# Altium project myMeteo_v0.PrjPcb
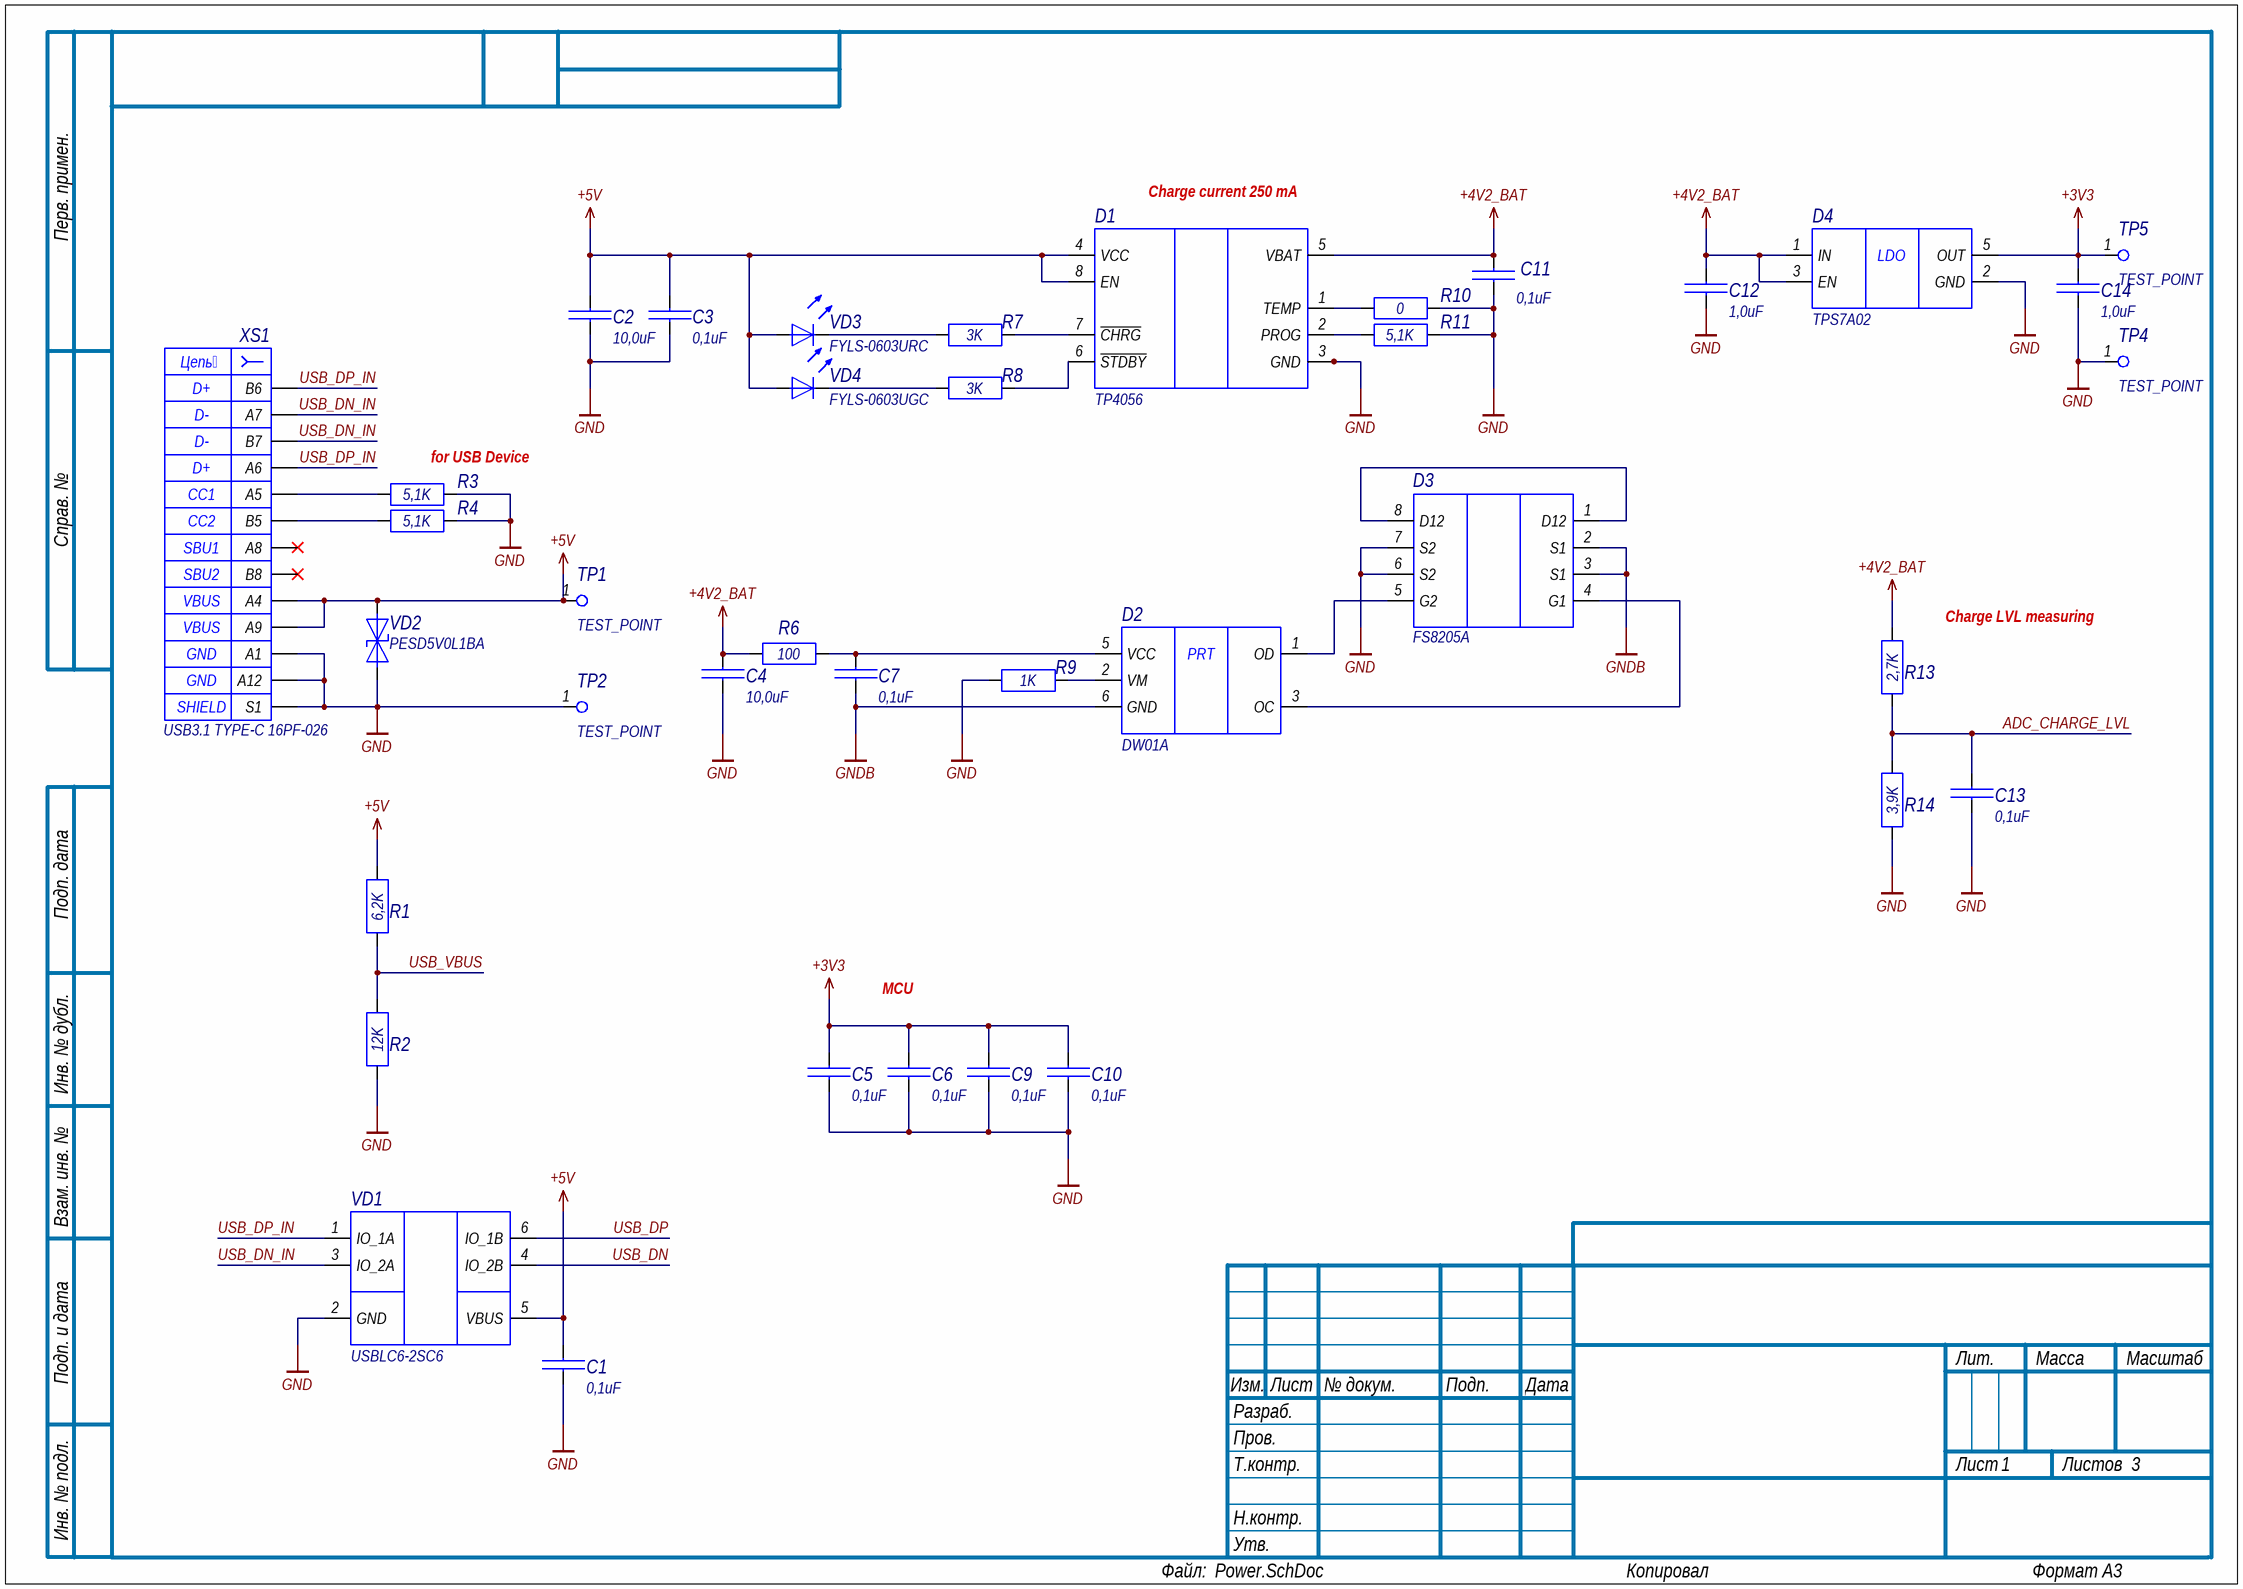
[diagram p0: Power.SchDoc]
3 sheets, 72 parts. Net scope: global (net labels, ports and power ports of the same name join across sheets).
Board file: myMeteo_v0.PcbDoc
Sheets:
  Power.SchDoc
  MCU.SchDoc
  Sensors.SchDoc

## Sheet Power.SchDoc
size 420 x 297 mm; SheetNumber: 1; SheetTotal: 3

### Parts
C1  value 0,1uF  [CAP_0603]  (hidden comment: CAPACITOR)
C2  value 10,0uF  [CAP_0603]  (hidden comment: CAPACITOR)
C3  value 0,1uF  [CAP_0603]  (hidden comment: CAPACITOR)
C4  value 10,0uF  [CAP_0603]  (hidden comment: CAPACITOR)
C5  value 0,1uF  [CAP_0603]  (hidden comment: CAPACITOR)
C6  value 0,1uF  [CAP_0603]  (hidden comment: CAPACITOR)
C7  value 0,1uF  [CAP_0603]  (hidden comment: CAPACITOR)
C9  value 0,1uF  [CAP_0603]  (hidden comment: CAPACITOR)
C10  value 0,1uF  [CAP_0603]  (hidden comment: CAPACITOR)
C11  value 0,1uF  [CAP_0603]  (hidden comment: CAPACITOR)
C12  value 1,0uF  [CAP_0603]  (hidden comment: CAPACITOR)
C13  value 0,1uF  [CAP_0603]  (hidden comment: CAPACITOR)
C14  value 1,0uF  [CAP_0603]  (hidden comment: CAPACITOR)
D1  TP4056  [ESOP-8]
D2  DW01A  [SOT-23-6]
D3  FS8205A  [TSSOP-8]
D4  TPS7A02  [SOT-23-5]
R1  value 6,2K  [RES_0603]  (hidden comment: RESISTOR)
R2  value 12K  [RES_0603]  (hidden comment: RESISTOR)
R3  value 5,1K  [RES_0603]  (hidden comment: RESISTOR)
R4  value 5,1K  [RES_0603]  (hidden comment: RESISTOR)
R6  value 100  [RES_0603]  (hidden comment: RESISTOR)
R7  value 3K  [RES_0603]  (hidden comment: RESISTOR)
R8  value 3K  [RES_0603]  (hidden comment: RESISTOR)
R9  value 1K  [RES_0603]  (hidden comment: RESISTOR)
R10  value 0  [RES_0603]  (hidden comment: RESISTOR)
R11  value 5,1K  [RES_0603]  (hidden comment: RESISTOR)
R13  value 2,7K  [RES_0603]  (hidden comment: RESISTOR)
R14  value 3,9K  [RES_0603]  (hidden comment: RESISTOR)
TP1  TEST_POINT  [TP-SMD-R0.9x0.85]  (no BOM)
TP2  TEST_POINT  [TP-SMD-R0.9x0.85]  (no BOM)
TP4  TEST_POINT  [TP-SMD-R0.9x0.85]  (no BOM)
TP5  TEST_POINT  [TP-SMD-R0.9x0.85]  (no BOM)
VD1  USBLC6-2SC6  [SOT-23-6]
VD2  value PESD5V0L1BA  [SOD-323F-NO-CATHODE]  (hidden comment: ZENER BIDIR)
VD3  value FYLS-0603URC  [LED_0603_R]  (hidden comment: LED)
VD4  value FYLS-0603UGC  [LED_0603_G]  (hidden comment: LED)
XS1  value USB3.1 TYPE-C 16PF-026  [USB3.1TYPE-C 16PF-26]  (hidden comment: USB3.1TYPE-C 16PF-26)

### Nets
+3V3: C5.1 C6.1 C9.1 C10.1 C14.2 D4.5(OUT) TP5.1
+4V2_BAT: C4.1 C11.1 C12.2 D1.5(VBAT) D4.1(IN) D4.3(EN) R6.1 R13.2
+5V: C1.1 C2.1 C3.1 D1.4(VCC) D1.8(EN) R1.2 TP1.1 VD1.5(VBUS) VD2.1 VD3.A VD4.A XS1.A4 XS1.A9
GND: C1.2 C2.2 C3.2 C4.2 C5.2 C6.2 C9.2 C10.2 C11.2 C12.1 C13.2 C14.1 D1.0(EPAD) D1.3(GND) D3.6(S2) D3.7(S2) D4.2(GND) R2.1 R3.2 R4.2 R9.1 R10.2 R11.2 R14.1 TP2.1 TP4.1 VD1.2(GND) VD2.2 XS1.A1 XS1.A12 XS1.S1
GNDB: C7.2 D2.6(GND) D3.2(S1) D3.3(S1)
ADC_CHARGE_LVL: C13.1 R13.1 R14.2
USB_DN: VD1.4(IO_2B)
USB_DN_IN: VD1.3(IO_2A) XS1.A7 XS1.B7
USB_DP: VD1.6(IO_1B)
USB_DP_IN: VD1.1(IO_1A) XS1.A6 XS1.B6
USB_VBUS: R1.1 R2.2
NetC7_1: C7.1 D2.5(VCC) R6.2
NetD1_1: D1.1(TEMP) R10.1
NetD1_2: D1.2(PROG) R11.1
NetD1_6: D1.6(~{STDBY}) R8.2
NetD1_7: D1.7(~{CHRG}) R7.2
NetD2_1: D2.1(OD) D3.5(G2)
NetD2_2: D2.2(VM) R9.2
NetD2_3: D2.3(OC) D3.4(G1)
NetD3_1: D3.1(D12) D3.8(D12)
NetR3_1: R3.1 XS1.A5
NetR4_1: R4.1 XS1.B5
NetR7_1: R7.1 VD3.K
NetR8_1: R8.1 VD4.K

Not connected (* = marked no-connect by the designer): XS1 A8* B8*

### Notes on the sheet
- (near D1) Charge current 250 mA
- (near R3) for USB Device
- Charge LVL measuring
- MCU
- Перв. примен.
- Справ. №
- Подп. дата
- Инв. № дубл.
- Взам. инв. №
- Подп. и дата
- Изм.
- Разраб.
- Лист
- № докум.
- Подп.
- Дата
- Лит.
- Масса
- Масштаб
- Пров.
- Т.контр.
- Листов
- Инв. № подл.
- Н.контр.
- Утв.
- Файл:
- Копировал
- Формат А3
- (in symbol DW01A) PRT
- (in symbol USB3.1 TYPE-C 16PF-026) Цепь; D+; D-; CC1; CC2; SBU1; SBU2; VBUS; GND; SHIELD

### Library data of the parts
C1 C3 C5-C7 C9-C11 C13 = CAP_CER_0603_104_25_10_X7R: Ceramic Capacitor SMD_0603 X7R; Manufacturer: Yageo; Manufacturer Part Number: CC0603KRX7R8BB104; Voltage: 25V; Tolerance: 10%; Part Number: CAP_CER_0603_104_25_10_X7R; Part Type: 0603; Size: 0603; Dielectric: X7R
C2 = CAP_CER_0603_106_25_10_X5R: Ceramic Capacitor SMD_0603 X5R; Manufacturer: Yageo; Manufacturer Part Number: CC0603KRX5R8BB106; Voltage: 25V; Tolerance: 10%; Replace: GRM188R61E106KA73D; Part Number: CAP_CER_0603_106_25_10_X5R; Part Type: 0603; Size: 0603; Dielectric: X5R
C4 = CAP_CER_0603_106_10_10_X5R: Ceramic Capacitor SMD_0603 X5R; Manufacturer: Yageo; Manufacturer Part Number: CC0603KRX5R6BB106; Voltage: 10V; Tolerance: 10%; Part Number: CAP_CER_0603_106_10_10_X5R; Part Type: 0603; Size: 0603; Dielectric: X5R
C12 C14 = CAP_CER_0603_105_25_10_X5R: Ceramic Capacitor SMD_0603 X5R; Manufacturer: Yageo; Manufacturer Part Number: CC0603KRX5R8BB105; Voltage: 25V; Tolerance: 10%; Part Number: CAP_CER_0603_105_25_10_X5R; Part Type: 0603; Size: 0603; Dielectric: X5R
D1 = TP4056: 1A Standalone Linear Li-Ion Battery Charger; Manufacturer: UMW; Value: TP4056; Part Number: TP4056; Part Type: POWER; Size: ESOP-8; Manufacturer Part Number: TP4056
D2 = DW01A: The DW01A battery protection IC is designed to / protect lithium-ion/polymer battery from damage or / degrading the lifetime due to overcharge, / overdischarge, and/or overcurrent for one-cell / lithium-ion/polymer battery powered systems, such as / cellular phones; Value: DW01A; Part Number: DW01A; Part Type: POWER; Size: SOT-23-6; Manufacturer: -; Manufacturer Part Number: DW01A
D3 = FS8205A: Dual N-Channel Enhancement Mode Power MOSFET; Manufacturer: Tech Public; Value: FS8205A; Part Number: FS8205A; Part Type: POWER; Size: TSSOP-8; Manufacturer Part Number: FS8205A
D4 = TPS7A02: TPS7A02 Nanopower IQ, 25-nA, 200-mA, Low-Dropout Voltage Regulator With Fast / Transient Response; Manufacturer: Texas Instruments; Manufacturer Part Number: TPS7A0236PDBVR; Value: TPS7A02; Part Number: TPS7A02; Part Type: LDO; Size: SOT-23-5
R1 = RES_SMD_0603_6K2_5%: Resistor fixed SMD_0603 5%; Manufacturer: Yageo; Manufacturer Part Number: RC0603JR-076K2L; Power: 100mW; Part Number: RES_SMD_0603_6K2_5%; Part Type: 0603; Tolerance: 5%; Size: 0603
R2 = RES_SMD_0603_12K_1%: Resistor fixed SMD_0603 1%; Manufacturer: Yageo; Manufacturer Part Number: RC0603FR-0712KL; Power: 100mW; Part Number: RES_SMD_0603_12K_1%; Part Type: 0603; Tolerance: 1%; Size: 0603
R3 R4 R11 = RES_SMD_0603_5K1_5%: Resistor fixed SMD_0603 5%; Manufacturer: Yageo; Manufacturer Part Number: RC0603JR-075K1L; Power: 100mW; Part Number: RES_SMD_0603_5K1_5%; Part Type: 0603; Tolerance: 5%; Size: 0603
R6 = RES_SMD_0603_100R_5%: Resistor fixed SMD_0603 5%; Manufacturer: Yageo; Manufacturer Part Number: RC0603JR-07100RL; Power: 100mW; Part Number: RES_SMD_0603_100R_5%; Part Type: 0603; Tolerance: 5%; Size: 0603
R7 R8 = RES_SMD_0603_3K_5%: Resistor fixed SMD_0603 5%; Manufacturer: Yageo; Manufacturer Part Number: RC0603JR-073KL; Power: 100mW; Part Number: RES_SMD_0603_3K_5%; Part Type: 0603; Tolerance: 5%; Size: 0603
R9 = RES_SMD_0603_1K_5%: Resistor fixed SMD_0603 5%; Manufacturer: Yageo; Manufacturer Part Number: RC0603JR-071KL; Power: 100mW; Part Number: RES_SMD_0603_1K_5%; Part Type: 0603; Tolerance: 5%; Size: 0603
R10 = RES_SMD_0603_0R_5%: Resistor fixed SMD_0603 5%; Manufacturer: Yageo; Manufacturer Part Number: RC0603JR-070RL; Power: 100mW; Part Number: RES_SMD_0603_0R_5%; Part Type: 0603; Tolerance: 5%; Size: 0603
R13 = RES_SMD_0603_2K7_5%: Resistor fixed SMD_0603 5%; Manufacturer: Yageo; Manufacturer Part Number: RC0603JR-072K7L; Power: 100mW; Part Number: RES_SMD_0603_2K7_5%; Part Type: 0603; Tolerance: 5%; Size: 0603
R14 = RES_SMD_0603_3K9_5%: Resistor fixed SMD_0603 5%; Manufacturer: Yageo; Manufacturer Part Number: RC0603JR-073K9L; Power: 100mW; Part Number: RES_SMD_0603_3K9_5%; Part Type: 0603; Tolerance: 5%; Size: 0603
TP1 TP2 TP4 TP5 = TP-SMD-R0.9x0.85: Test Point, SMP Pad, 0.9x0.85mm; Value: TP; Part Number: TP-SMD-R0.9x0.85; Part Type: TP-SMD-R0.9x0.85
VD1 = USBLC6-2SC6: Low Capacitance 2-Line ESD Protection for USB Protection; Manufacturer: UMW; Voltage: 5V; Replace: USBLC6-2SC6 (STM); Value: USBLC6-2SC6; Part Number: USBLC6-2SC6; Part Type: ESD; Size: SOT-23-6; Manufacturer Part Number: USBLC6-2SC6
VD2 = PESD5V0L1BA: Low Capacitance Bidirectional ESD Protection Diode; Manufacturer: UMW; Voltage: 5V; Part Number: PESD5V0L1BA; Part Type: ESD; Size: SOD-323; Manufacturer Part Number: PESD5V0L1BA
VD3 = FYLS-0603URC: SMD 0603 LED Red; Manufacturer: Foryard; Part Number: FYLS-0603URC; Part Type: LED; Size: 0603; Manufacturer Part Number: FYLS-0603URC
VD4 = FYLS-0603UGC: SMD 0603 LED Green; Manufacturer: Foryard; Replace: BL-HGE36G-AV-TR8; Part Number: FYLS-0603UGC; Part Type: LED; Size: 0603; Manufacturer Part Number: FYLS-0603UGC
XS1 = USB3.1 TYPE-C 16PF-026: USB3.1 as USB2.0. Original: USB4110-GF_A; Manufacturer: RUICHI; Manufacturer Part Number: RUICHI USB3.1 TYPE-C; Replace: USB4110-GF-A (GCT); Part Number: USB3.1 TYPE-C 16PF-026; Part Type: PC

## Sheet MCU.SchDoc
size 420 x 297 mm; Author: ALTIUM GOSTBOM2.0 KEV; SheetNumber: 2; SheetTotal: 3
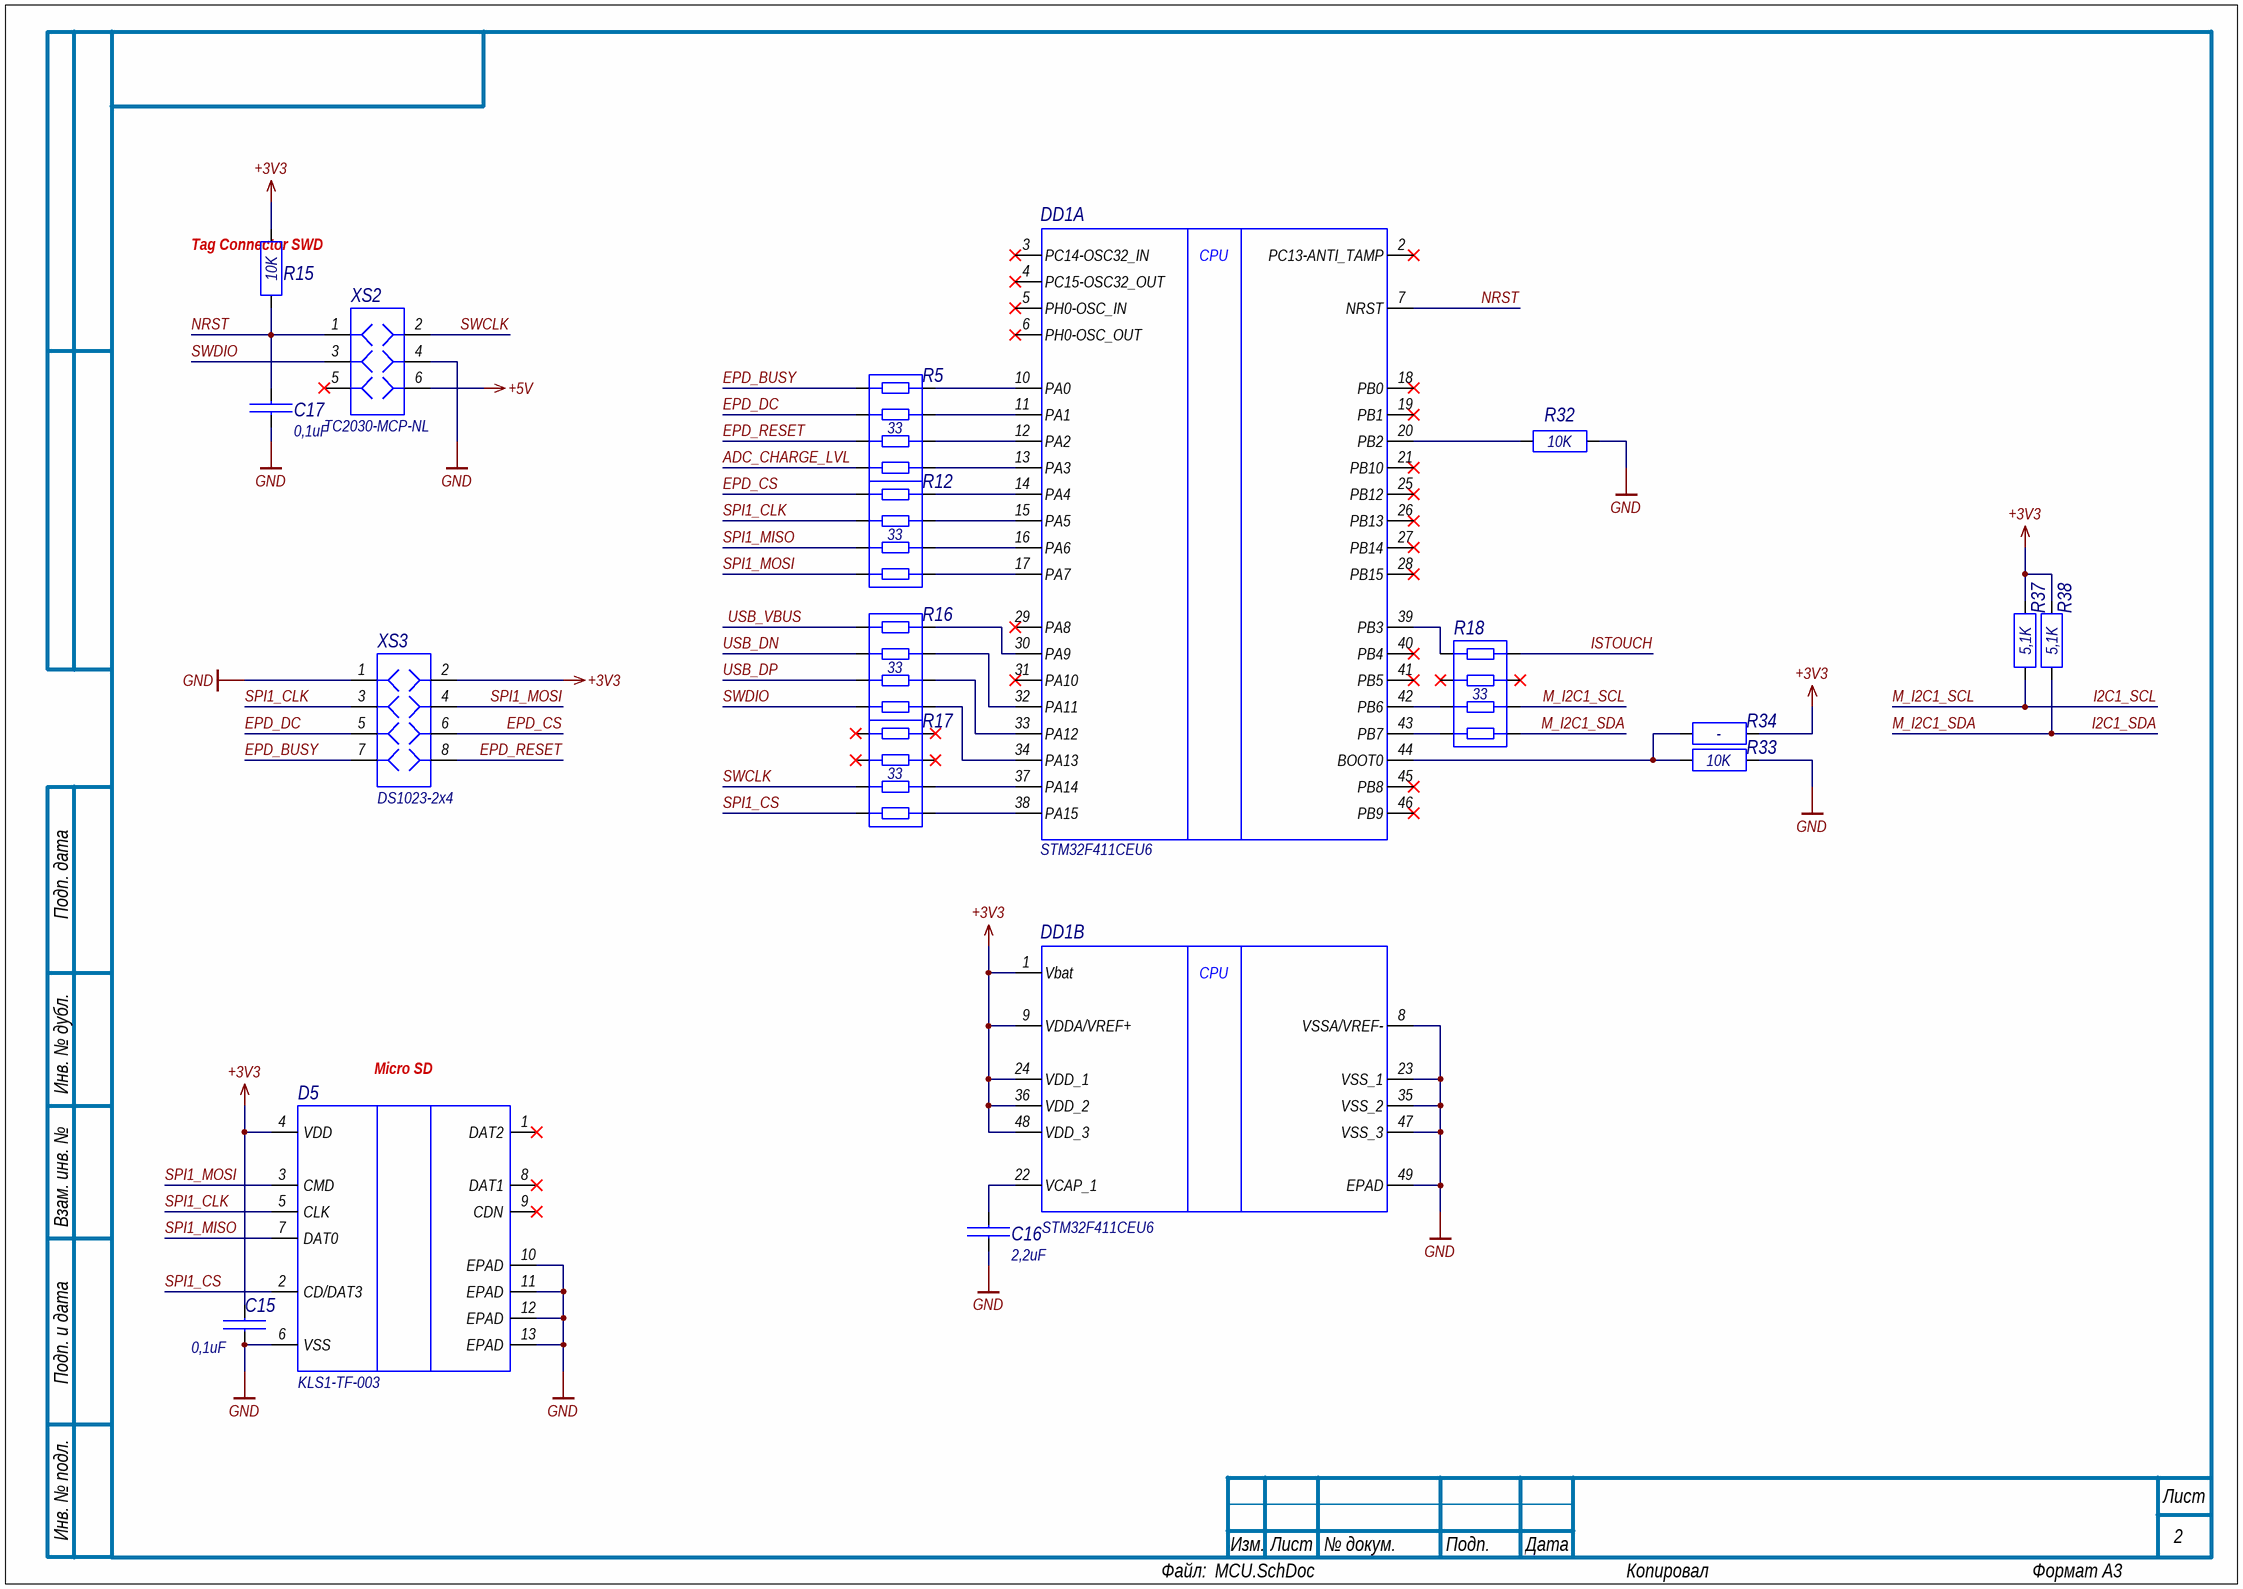
[diagram p1: MCU.SchDoc]

### Parts
C15  value 0,1uF  [CAP_0603]  (hidden comment: CAPACITOR)
C16  value 2,2uF  [CAP_0603]  (hidden comment: CAPACITOR)
C17  value 0,1uF  [CAP_0603]  (hidden comment: CAPACITOR)
D5  KLS1-TF-003  [KLS1-TF-003]
DD1  STM32F411CEU6  [UFQFPN48]  (parts A,B of 2)
R5  value 33  [RES_ARRAY_0804_CONVEX]  (hidden comment: RESISTOR_ARRAY)
R12  value 33  [RES_ARRAY_0804_CONVEX]  (hidden comment: RESISTOR_ARRAY)
R15  value 10K  [RES_0603]  (hidden comment: RESISTOR)
R16  value 33  [RES_ARRAY_0804_CONVEX]  (hidden comment: RESISTOR_ARRAY)
R17  value 33  [RES_ARRAY_0804_CONVEX]  (hidden comment: RESISTOR_ARRAY)
R18  value 33  [RES_ARRAY_0804_CONVEX]  (hidden comment: RESISTOR_ARRAY)
R32  value 10K  [RES_0603]  (hidden comment: RESISTOR)
R33  value 10K  [RES_0603]  (hidden comment: RESISTOR)
R34  RESISTOR  [RES_0603]  (value not drawn)  (no BOM)
R37  value 5,1K  [RES_0603]  (hidden comment: RESISTOR)
R38  value 5,1K  [RES_0603]  (hidden comment: RESISTOR)
XS2  value TC2030-MCP-NL  [TC2030-MCP-NL]  (hidden comment: HEADER-3x2-F)
XS3  value DS1023-2x4  [PBD-8]  (hidden comment: HEADER-4x2-F)

### Nets
+3V3: C15.1 D5.4(VDD) DD1.1(Vbat) DD1.9(VDDA/VREF+) DD1.24(VDD_1) DD1.36(VDD_2) DD1.48(VDD_3) R15.2 R34.2 R37.2 R38.2 XS3.2
+5V: XS2.6
GND: C15.2 C16.2 C17.2 D5.6(VSS) D5.10(EPAD) D5.11(EPAD) D5.12(EPAD) D5.13(EPAD) DD1.8(VSSA/VREF-) DD1.23(VSS_1) DD1.35(VSS_2) DD1.47(VSS_3) DD1.49(EPAD) R32.2 R33.2 XS2.4 XS3.1
ADC_CHARGE_LVL: R5.4
EPD_BUSY: R5.1 XS3.7
EPD_CS: R12.1 XS3.6
EPD_DC: R5.2 XS3.5
EPD_RESET: R5.3 XS3.8
I2C1_SCL: R18.7 R37.1  [also labelled M_I2C1_SCL]
I2C1_SDA: R18.8 R38.1  [also labelled M_I2C1_SDA]
ISTOUCH: R18.5
NRST: C17.1 DD1.7(NRST) R15.1 XS2.1
SPI1_CLK: D5.5(CLK) R12.2 XS3.3
SPI1_CS: D5.2(CD/DAT3) R17.4
SPI1_MISO: D5.7(DAT0) R12.3
SPI1_MOSI: D5.3(CMD) R12.4 XS3.4
SWCLK: R17.3 XS2.2
SWDIO: R16.4 XS2.3
USB_DN: R16.2
USB_DP: R16.3
USB_VBUS: R16.1
NetC16_1: C16.1 DD1.22(VCAP_1)
NetDD1_10: DD1.10(PA0) R5.8
NetDD1_11: DD1.11(PA1) R5.7
NetDD1_12: DD1.12(PA2) R5.6
NetDD1_13: DD1.13(PA3) R5.5
NetDD1_14: DD1.14(PA4) R12.8
NetDD1_15: DD1.15(PA5) R12.7
NetDD1_16: DD1.16(PA6) R12.6
NetDD1_17: DD1.17(PA7) R12.5
NetDD1_20: DD1.20(PB2) R32.1
NetDD1_30: DD1.30(PA9) R16.8
NetDD1_32: DD1.32(PA11) R16.7
NetDD1_33: DD1.33(PA12) R16.6
NetDD1_34: DD1.34(PA13) R16.5
NetDD1_37: DD1.37(PA14) R17.6
NetDD1_38: DD1.38(PA15) R17.5
NetDD1_39: DD1.39(PB3) R18.4
NetDD1_42: DD1.42(PB6) R18.2
NetDD1_43: DD1.43(PB7) R18.1
NetDD1_44: DD1.44(BOOT0) R33.1 R34.1

Not connected (* = marked no-connect by the designer): D5 1(DAT2)* 8(DAT1)* 9(CDN)*; DD1 2(PC13-ANTI_TAMP)* 3(PC14-OSC32_IN)* 4(PC15-OSC32_OUT)* 5(PH0-OSC_IN)* 6(PH0-OSC_OUT)* 18(PB0)* 19(PB1)* 21(PB10)* 25(PB12)* 26(PB13)* 27(PB14)* 28(PB15)* 29(PA8)* 31(PA10)* 40(PB4)* 41(PB5)* 45(PB8)* 46(PB9)*; R17 1* 2* 7* 8*; R18 3* 6*; XS2 5*

### Notes on the sheet
- Tag Connector SWD
- (near D5) Micro SD
- Подп. дата
- Инв. № дубл.
- Взам. инв. №
- Подп. и дата
- Инв. № подл.
- Изм.
- Лист
- № докум.
- Подп.
- Дата
- Файл:
- Копировал
- Формат А3
- (in symbol STM32F411CEU6, part A) CPU
- (in symbol STM32F411CEU6, part B) CPU

### Library data of the parts
C15 C17 = CAP_CER_0603_104_25_10_X7R: as C1 on sheet Power; Part Number: CAP_CER_0603_104_25_10_X7R; Part Type: 0603; Size: 0603; Dielectric: X7R
C16 = CAP_CER_0603_225_10_10_X5R: Ceramic Capacitor SMD_0603 X5R; Manufacturer: Yageo; Manufacturer Part Number: CC0603KRX5R6BB225; Voltage: 10V; Tolerance: 10%; Part Number: CAP_CER_0603_225_10_10_X5R; Part Type: 0603; Size: 0603; Dielectric: X5R
D5 = KLS1-TF-003: microSD Card Connector; Manufacturer: KLS; Value: KLS1-TF-003; Part Number: KLS1-TF-003; Part Type: CARD; Manufacturer Part Number: KLS1-TF-003
DD1 = STM32F411CEU6: Arm Cortex-M4 32b MCU+FPU, 125 DMIPS, 512KB Flash, / 128KB RAM, USB OTG FS, 11 TIMs, 1 ADC, 13 comm. interfaces; Manufacturer_Name: STMicroelectronics; Geometry.Height: 0.6mm; Manufacturer_Part_Number: STM32F411CEU6; Mouser Part Number: 511-STM32F411CEU6; Mouser Price/Stock: https://www.mouser.co.uk/ProductDetail/STMicroelectronics/STM32F411CEU6?qs=pjMTYa9MTGV3ou31YBFa3g%3D%3D; Arrow Part Number: STM32F411CEU6; Arrow Price/Stock: https://www.arrow.com/en/products/stm32f411ceu6/stmicroelectronics?utm_currency=USD&region=nac; Datasheet Link: http://www.st.com/content/ccc/resource/technical/document/datasheet/b3/a5/46/3b/b4/e5/4c/85/DM00115249.pdf/files/DM00115249.pdf/jcr:content/translations/en.DM00115249.pdf; Part Number: STM32F411CEU6; Part Type: MCU; Value: STM32F411CEU6; Size: UFQFPN48; Manufacturer: STMicroelectronics; Manufacturer Part Number: STM32F411CEU6
R5 R12 R16-R18 = RES_ARR_CAY10_33R: CAY10 Series - Chip Resistor Array; Manufacturer: Yageo; Manufacturer Part Number: YC124-JR-0733RL; Tolerance: 5%; Power: 31mW; Replace: CAY10-330J4LF; Part Number: RES_ARR_CAY10_33R; Part Type: ARRAY; Size: 0804
R15 R32-R34 = RES_SMD_0603_10K_5%: Resistor fixed SMD_0603 5%; Manufacturer: Yageo; Manufacturer Part Number: RC0603JR-0710KL; Power: 100mW; Part Number: RES_SMD_0603_10K_5%; Part Type: 0603; Tolerance: 5%; Size: 0603
  R34: Value: -
R37 R38 = RES_SMD_0603_5K1_5%: as R3 on sheet Power; Part Number: RES_SMD_0603_5K1_5%; Part Type: 0603; Tolerance: 5%; Size: 0603
XS2 = TC2030-MCP-NL: Tag connector 2x3; Part Number: TC2030-MCP-NL; Part Type: HEADER; Manufacturer: Tag Connect; Manufacturer Part Number: TC2030-MCP-NL
XS3 = PBD-8: Female Socket Header Through Hole 8 (2x4) Position 0.100" (2.54mm); Manufacturer: Connfly; Manufacturer Part Number: DS1023-2x4S21; Part Number: PBD-8; Part Type: HEADER; Replace: PBD-8

## Sheet Sensors.SchDoc
size 209 x 297 mm; Author: ALTIUM GOSTBOM2.0 KEV; SheetNumber: 3; SheetTotal: 3
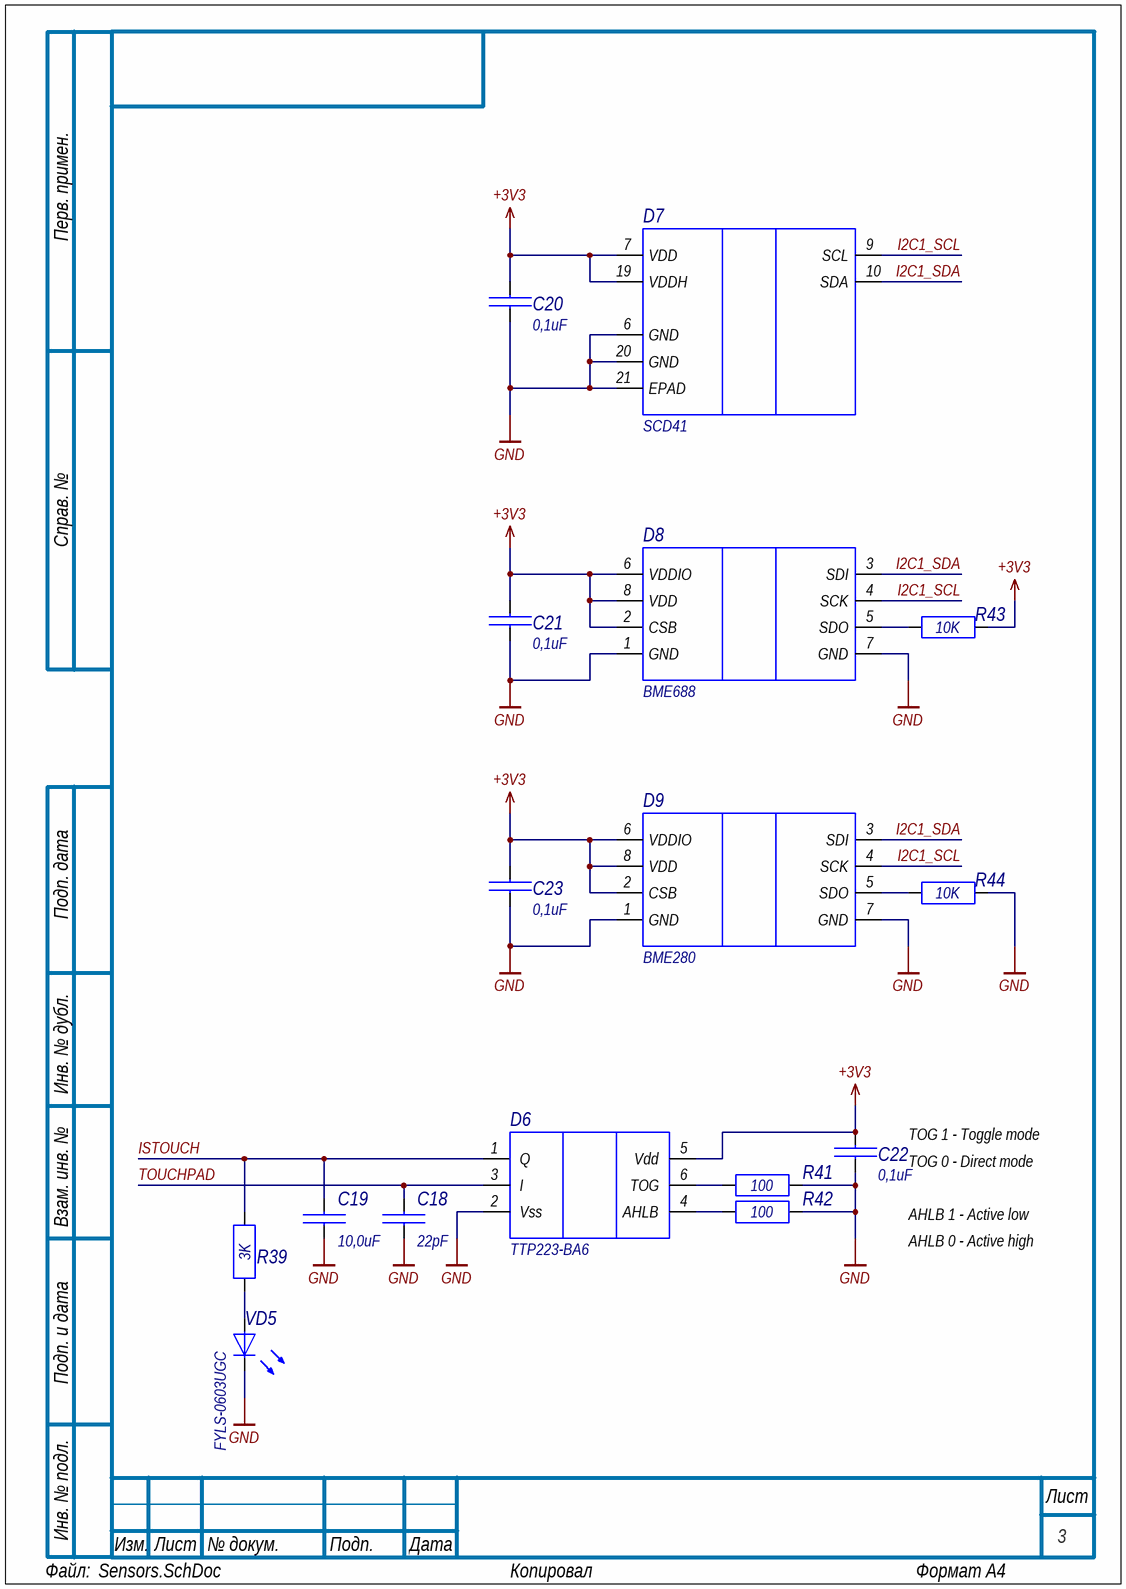
[diagram p2: Sensors.SchDoc]

### Parts
C18  value 22pF  [CAP_0603]  (hidden comment: CAPACITOR)
C19  value 10,0uF  [CAP_0603]  (hidden comment: CAPACITOR)
C20  value 0,1uF  [CAP_0603]  (hidden comment: CAPACITOR)
C21  value 0,1uF  [CAP_0603]  (hidden comment: CAPACITOR)
C22  value 0,1uF  [CAP_0603]  (hidden comment: CAPACITOR)
C23  value 0,1uF  [CAP_0603]  (hidden comment: CAPACITOR)
D6  TTP223-BA6  [SOT-23-6L_1]
D7  SCD41  [SCD41]
D8  value BME688  [BME688]  (hidden comment: BME_SENSOR)
D9  value BME280  [BME280]  (hidden comment: BME_SENSOR)
R39  value 3K  [RES_0603]  (hidden comment: RESISTOR)
R41  value 100  [RES_0603]  (hidden comment: RESISTOR)
R42  value 100  [RES_0603]  (hidden comment: RESISTOR)
R43  value 10K  [RES_0603]  (hidden comment: RESISTOR)
R44  value 10K  [RES_0603]  (hidden comment: RESISTOR)
VD5  value FYLS-0603UGC  [LED_0603_G]  (hidden comment: LED)

### Nets
+3V3: C20.1 C21.1 C22.1 C23.1 D6.5(Vdd) D7.7(VDD) D7.19(VDDH) D8.2(CSB) D8.6(VDDIO) D8.8(VDD) D9.2(CSB) D9.6(VDDIO) D9.8(VDD) R43.2
GND: C18.1 C19.2 C20.2 C21.2 C22.2 C23.2 D6.2(Vss) D7.6(GND) D7.20(GND) D7.21(EPAD) D8.1(GND) D8.7(GND) D9.1(GND) D9.7(GND) R41.2 R42.2 R44.2 VD5.K
I2C1_SCL: D7.9(SCL) D8.4(SCK) D9.4(SCK)
I2C1_SDA: D7.10(SDA) D8.3(SDI) D9.3(SDI)
ISTOUCH: C19.1 D6.1(Q) R39.2
TOUCHPAD: C18.2 D6.3(I)
NetD6_4: D6.4(AHLB) R42.1
NetD6_6: D6.6(TOG) R41.1
NetD8_5: D8.5(SDO) R43.1
NetD9_5: D9.5(SDO) R44.1
NetR39_1: R39.1 VD5.A

### Notes on the sheet
- (near C22) TOG 1 - Toggle mode
- (near C22) TOG 0 - Direct mode
- AHLB 1 - Active low
- AHLB 0 - Active high
- Перв. примен.
- Справ. №
- Подп. дата
- Инв. № дубл.
- Взам. инв. №
- Подп. и дата
- Инв. № подл.
- Изм.
- Лист
- № докум.
- Подп.
- Дата
- Файл:
- Копировал
- Формат А4

### Library data of the parts
C18 = CAP_CER_0603_220_50_5_C0G: Ceramic Capacitor SMD_0603 C0G; Manufacturer: Yageo; Manufacturer Part Number: CC0603JRNPO9BN220; Voltage: 50V; Tolerance: 5%; Part Number: CAP_CER_0603_220_50_5_C0G; Part Type: 0603; Size: 0603; Dielectric: C0G
C19 = CAP_CER_0603_106_25_10_X5R: as C2 on sheet Power; Part Number: CAP_CER_0603_106_25_10_X5R; Part Type: 0603; Size: 0603; Dielectric: X5R
C20-C23 = CAP_CER_0603_104_25_10_X7R: as C1 on sheet Power; Part Number: CAP_CER_0603_104_25_10_X7R; Part Type: 0603; Size: 0603; Dielectric: X7R
D6 = TTP223-BA6: A touch pad detector; Manufacturer: Tontek; Value: TTP223-BA6; Part Number: TTP223-BA6; Part Type: LOGIC; Size: SOT-23-6L_1; Manufacturer Part Number: TTP223-BA6
D7 = SCD41: Replace: The SCD4x is SensirionвЂ™s next generation miniature CO2 / sensor; Value: SCD41; Part Number: SCD41; Part Type: LOGIC; Size: SCD41; Manufacturer: SCD41; Manufacturer Part Number: SCD41
D8 = BME688: Part Number: BME688; Part Type: LOGIC; Size: SMD-8P; Manufacturer: BME688; Manufacturer Part Number: BME688
D9 = BME280: Part Number: BME280; Part Type: LOGIC; Size: LGA-8(2.5x2.5); Manufacturer: BME280; Manufacturer Part Number: BME280
R39 = RES_SMD_0603_3K_5%: as R7 on sheet Power; Part Number: RES_SMD_0603_3K_5%; Part Type: 0603; Tolerance: 5%; Size: 0603
R41 R42 = RES_SMD_0603_100R_5%: as R6 on sheet Power; Part Number: RES_SMD_0603_100R_5%; Part Type: 0603; Tolerance: 5%; Size: 0603
R43 R44 = RES_SMD_0603_10K_5%: as R15 on sheet MCU; Part Number: RES_SMD_0603_10K_5%; Part Type: 0603; Tolerance: 5%; Size: 0603
VD5 = FYLS-0603UGC: as VD4 on sheet Power; Part Number: FYLS-0603UGC; Part Type: LED; Size: 0603; Manufacturer Part Number: FYLS-0603UGC

## Nets that join several sheets
+3V3: Power (7 pins), MCU (12 pins), Sensors (14 pins)
+5V: Power (13 pins), MCU (XS2.6)
GND: Power (31 pins), MCU (17 pins), Sensors (18 pins)
ADC_CHARGE_LVL: Power (C13.1 R13.1 R14.2), MCU (R5.4)
I2C1_SCL: MCU (R18.7 R37.1), Sensors (D7.9 D8.4 D9.4)
I2C1_SDA: MCU (R18.8 R38.1), Sensors (D7.10 D8.3 D9.3)
ISTOUCH: MCU (R18.5), Sensors (C19.1 D6.1 R39.2)
USB_DN: Power (VD1.4), MCU (R16.2)
USB_DP: Power (VD1.6), MCU (R16.3)
USB_VBUS: Power (R1.1 R2.2), MCU (R16.1)